# Altium schematic sheet 3_InfoPerif.SchDoc
size 414 x 293 mm; SheetNumber: 3; SheetTotal: 4
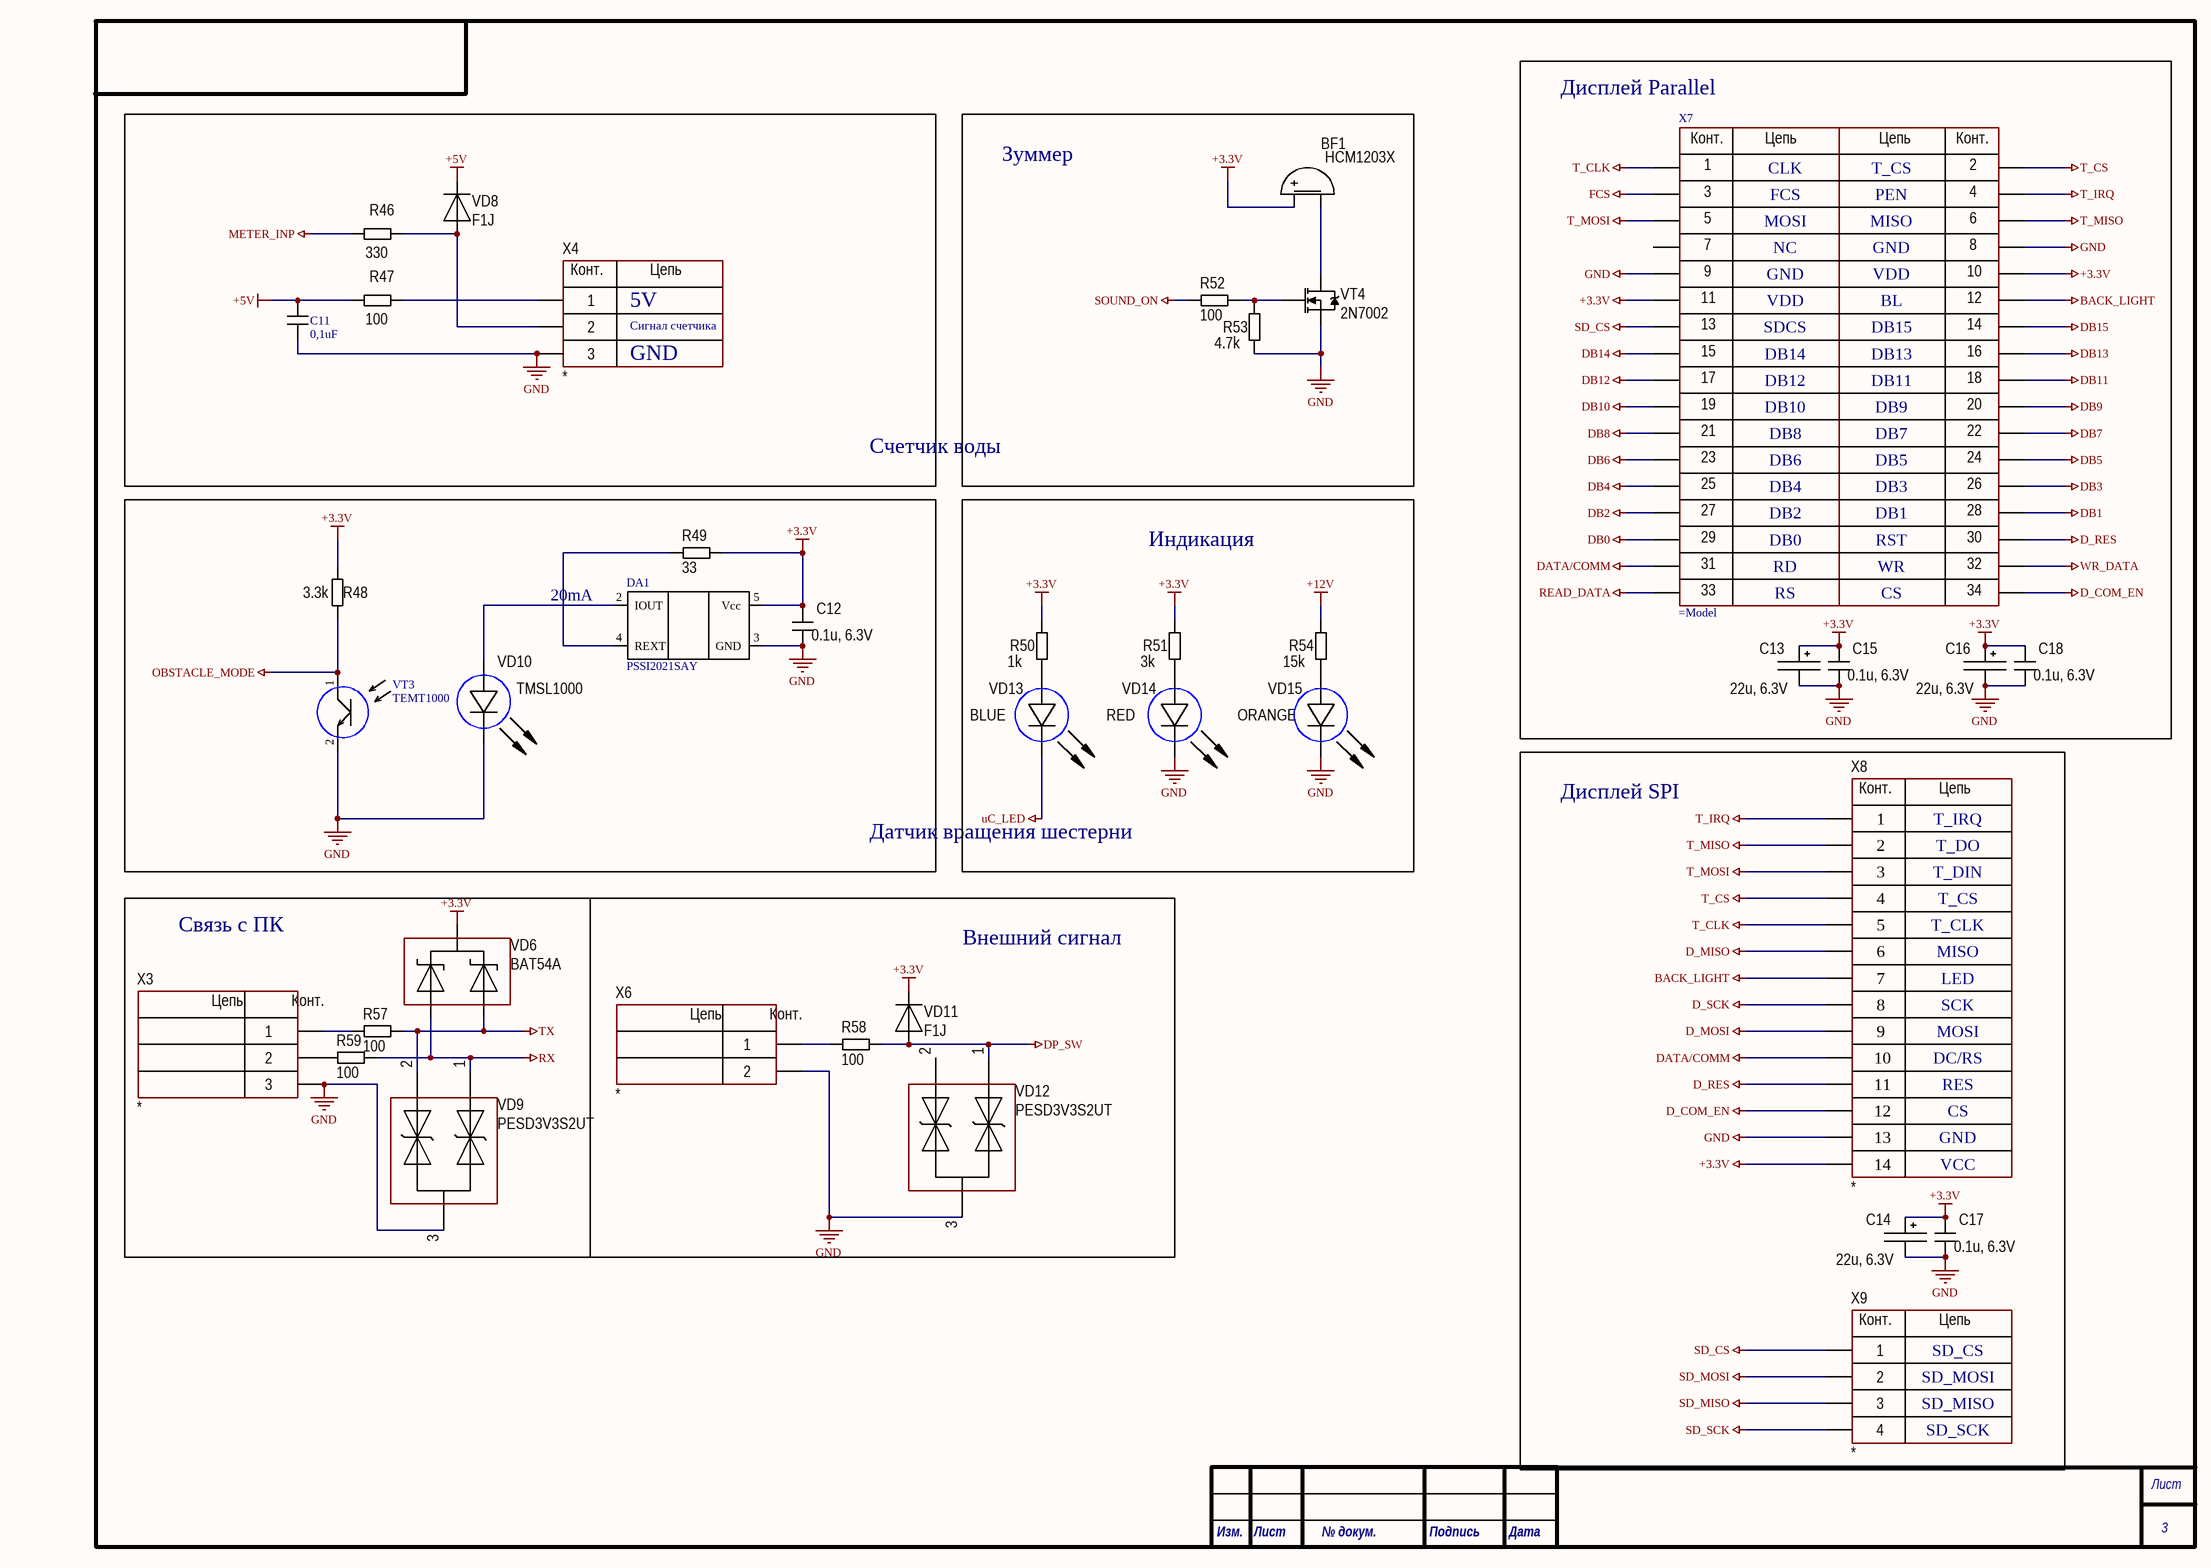
[diagram p0: 3_InfoPerif.SchDoc]

## Parts
BF1  HCM1203X  [BUZ: AI-1223-TWT-3V-2-R]
C11  0,1uF  [C_0603]
C12  0.1u, 6.3V  [CH0805C]
C13  22u, 6.3V  [TANTAL_B]
C14  22u, 6.3V  [TANTAL_B]
C15  0.1u, 6.3V  [CH0805C]
C16  22u, 6.3V  [TANTAL_B]
C17  0.1u, 6.3V  [CH0805C]
C18  0.1u, 6.3V  [CH0805C]
DA1  PSSI2021SAY  [SOT353]
R46  330  [CH0805R]
R47  100  [CH2512R]
R48  3.3k  [CH0805R]
R49  33  [CH0805R]
R50  1k  [CH0805R]
R51  3k  [CH0805R]
R52  100  [CH0805R]
R53  4.7k  [CH0805R]
R54  15k  [CH0805R]
R57  100  [CH0805R]
R58  100  [CH0805R]
R59  100  [CH0805R]
VD6  BAT54A  [SOT23_123]
VD8  F1J  [SOD123F]
VD9  PESD3V3S2UT  [SOT23_132]
VD10  TMSL1000  [TSML1000]
VD11  F1J  [SOD123F]
VD12  PESD3V3S2UT  [SOT23_132]
VD13  BLUE  [CH0603LB]
VD14  RED  [CH0603LB]
VD15  ORANGE  [CH0603LB]
VT3  TEMT1000  [TEMT1000]
VT4  2N7002  [SOT23_123]
X3  *  [CON: CWF-3]
X4  *  [CON: CWF-3]
X6  *  [CON: CWF-2]
X7  (no value)  [DS1023-34]
X8  *  [DS1024-14]
X9  *  [DS1023-4]

## Blocks framed on the sheet
Дисплей Parallel: C13 C15 C16 C18 X7
Зуммер: BF1 R52 R53 VT4
Датчик вращения шестерни: C12 DA1 R48 R49 VD10 VT3
Индикация: R50 R51 R54 VD13-VD15
Дисплей SPI: C14 C17 X8 X9
Связь с ПК: R57 R59 VD6 VD9 X3
Внешний сигнал: R58 VD11 VD12 X6

## Nets
+3.3V: BF1.1(+) C12.2 C13.1 C14.1 C15.2 C16.1 C17.2 C18.2 DA1.5(Vcc) R48.2 R49.2 R50.2 R51.2 VD6.2 VD11.2 X7.10 X7.11 X8.14
+5V: C11.2 R47.1 VD8.2
+12V: R54.2
BACK_LIGHT: X7.12 X8.7
D_COM_EN: X7.34 X8.12
D_MISO: X8.6
D_MOSI: X8.9
D_RES: X7.30 X8.11
D_SCK: X8.8
DATA/COMM: X7.31 X8.10
DB0: X7.29
DB1: X7.28
DB2: X7.27
DB3: X7.26
DB4: X7.25
DB5: X7.24
DB6: X7.23
DB7: X7.22
DB8: X7.21
DB9: X7.20
DB10: X7.19
DB11: X7.18
DB12: X7.17
DB13: X7.16
DB14: X7.15
DB15: X7.14
DP_SW: R58.2 VD11.1 VD12.1
FCS: X7.3
GND: C11.1 C12.1 C13.2 C14.2 C15.1 C16.2 C17.1 C18.1 DA1.3(GND) R53.1 VD9.3 VD10.2(C) VD12.3 VD14.2(C) VD15.2(C) VT3.2 VT4.3(S) X3.3 X4.3 X6.2 X7.8 X7.9 X8.13
METER_INP: R46.1
OBSTACLE_MODE: R48.1 VT3.1
READ_DATA: X7.33
RX: R59.2 VD6.3 VD9.1
SD_CS: X7.13 X9.1
SD_MISO: X9.3
SD_MOSI: X9.2
SD_SCK: X9.4
SOUND_ON: R52.2
T_CLK: X7.1 X8.5
T_CS: X7.2 X8.4
T_IRQ: X7.4 X8.1
T_MISO: X7.6 X8.2
T_MOSI: X7.5 X8.3
TX: R57.2 VD6.1 VD9.2
uC_LED: VD13.2(C)
WR_DATA: X7.32
NetBF1_2: BF1.2(-) VT4.2(D)
NetDA1_2: DA1.2(IOUT) VD10.1(A)
NetDA1_4: DA1.4(REXT) R49.1
NetR46_2: R46.2 VD8.1 X4.2
NetR47_2: R47.2 X4.1
NetR50_1: R50.1 VD13.1(A)
NetR51_1: R51.1 VD14.1(A)
NetR52_1: R52.1 R53.2 VT4.1(G)
NetR54_1: R54.1 VD15.1(A)
NetR57_1: R57.1 X3.1
NetR58_1: R58.1 X6.1
NetR59_1: R59.1 X3.2

Not connected (* = marked no-connect by the designer): VD12 2; X7 7

## Notes on the sheet
- (near X7) CLK
- (near X7) T_CS
- (near X7) FCS
- (near X7) MOSI
- (near X7) MISO
- (near X7) PEN
- 5V
- (near X7) NC
- (near X7) GND
- (near X7) VDD
- (near X7) BL
- GND
- Сигнал счетчика
- (near X7) SDCS
- (near X7) DB14
- (near X7) DB12
- (near X7) DB11
- (near X7) DB13
- (near X7) DB15
- (near X7) DB8
- (near X7) DB10
- (near X7) DB7
- (near X7) DB9
- Счетчик воды
- (near X7) DB2
- (near X7) DB4
- (near X7) DB6
- (near X7) DB1
- (near X7) DB3
- (near X7) DB5
- (near X7) DB0
- (near X7) RD
- (near X7) WR
- (near X7) RST
- 20mA
- (near X7) RS
- (near X7) CS
- T_IRQ
- T_DO
- T_DIN
- T_CS
- T_CLK
- MISO
- LED
- SCK
- MOSI
- DC/RS
- RES
- CS
- VCC
- SD_CS
- SD_MOSI
- SD_MISO
- SD_SCK
- Лист
- Изм.
- № докум.
- Подпись
- Дата
- (in symbol 2-Connector) Цепь; Конт.
- (in symbol 3-Connector) Конт.; Цепь
- (in symbol 4-Connector) Конт.; Цепь
- (in symbol 14-Connector) Конт.; Цепь
- (in symbol 34-Connector) Конт.; Цепь

## Library data of the parts
BF1 = Buzzer: Manufacturer: PUI Audio, Inc.; Model: AI-1223-TWT-3V-2-R; HelpURL: https://www.digikey.com/product-detail/en/pui-audio-inc/AI-1223-TWT-3V-2-R/668-1456-ND/5011391; ComponentKind: Internally Driven
C11 = C_SMD
C12 = Capacitor: 0805; Manufacturer: *; Model: *; HelpURL: *; ComponentKind: *; Value: *
C13 C14 C16 = TantalCap: Manufacturer: *; Model: *; HelpURL: *; ComponentKind: *; Value: *
C15 C17 C18 = Capacitor: Manufacturer: *; Model: *; HelpURL: *; ComponentKind: *; Value: *
DA1 = PSSI2021SAY: Iout = 0.617/Rext + 15 µA
R46 R47 R50-R54 R57-R59 = Resistor: Manufacturer: *; Model: *; HelpURL: *; ComponentKind: *; Value: *
R48 R49 = Resistor: 0805; Manufacturer: *; Model: *; HelpURL: *; ComponentKind: *; Value: *
VD6 = Diod Schottky Array v.1: ComponentKind: *; Manufacturer: *; Model: *; HelpURL: *
VD8 VD11 = Diod: ComponentKind: *; Manufacturer: *; Model: *; HelpURL: *
VD9 VD12 = TVS Array: ComponentKind: *; Manufacturer: *; Model: *; HelpURL: *
VD10 VD13-VD15 = LED_1: Manufacturer: *; Model: *; HelpURL: *; ComponentKind: *; Value: *
VT4 = N-chanel: Mosfet; Model: *; Manufacturer: *; ComponentKind: *; HelpURL: *
X3 X4 = 3-Connector: Model: *; Manufacturer: *; HelpURL: *; ComponentKind: *
X6 = 2-Connector: Model: *; Manufacturer: *; HelpURL: *; ComponentKind: *
X7 = 34-Connector
X8 = 14-Connector: Model: *; Manufacturer: *; HelpURL: *; ComponentKind: *
X9 = 4-Connector: Model: *; Manufacturer: *; HelpURL: *; ComponentKind: *